# EasyEDA Pro project 轮足机器人主板&核心板.epro, board 主板PCB
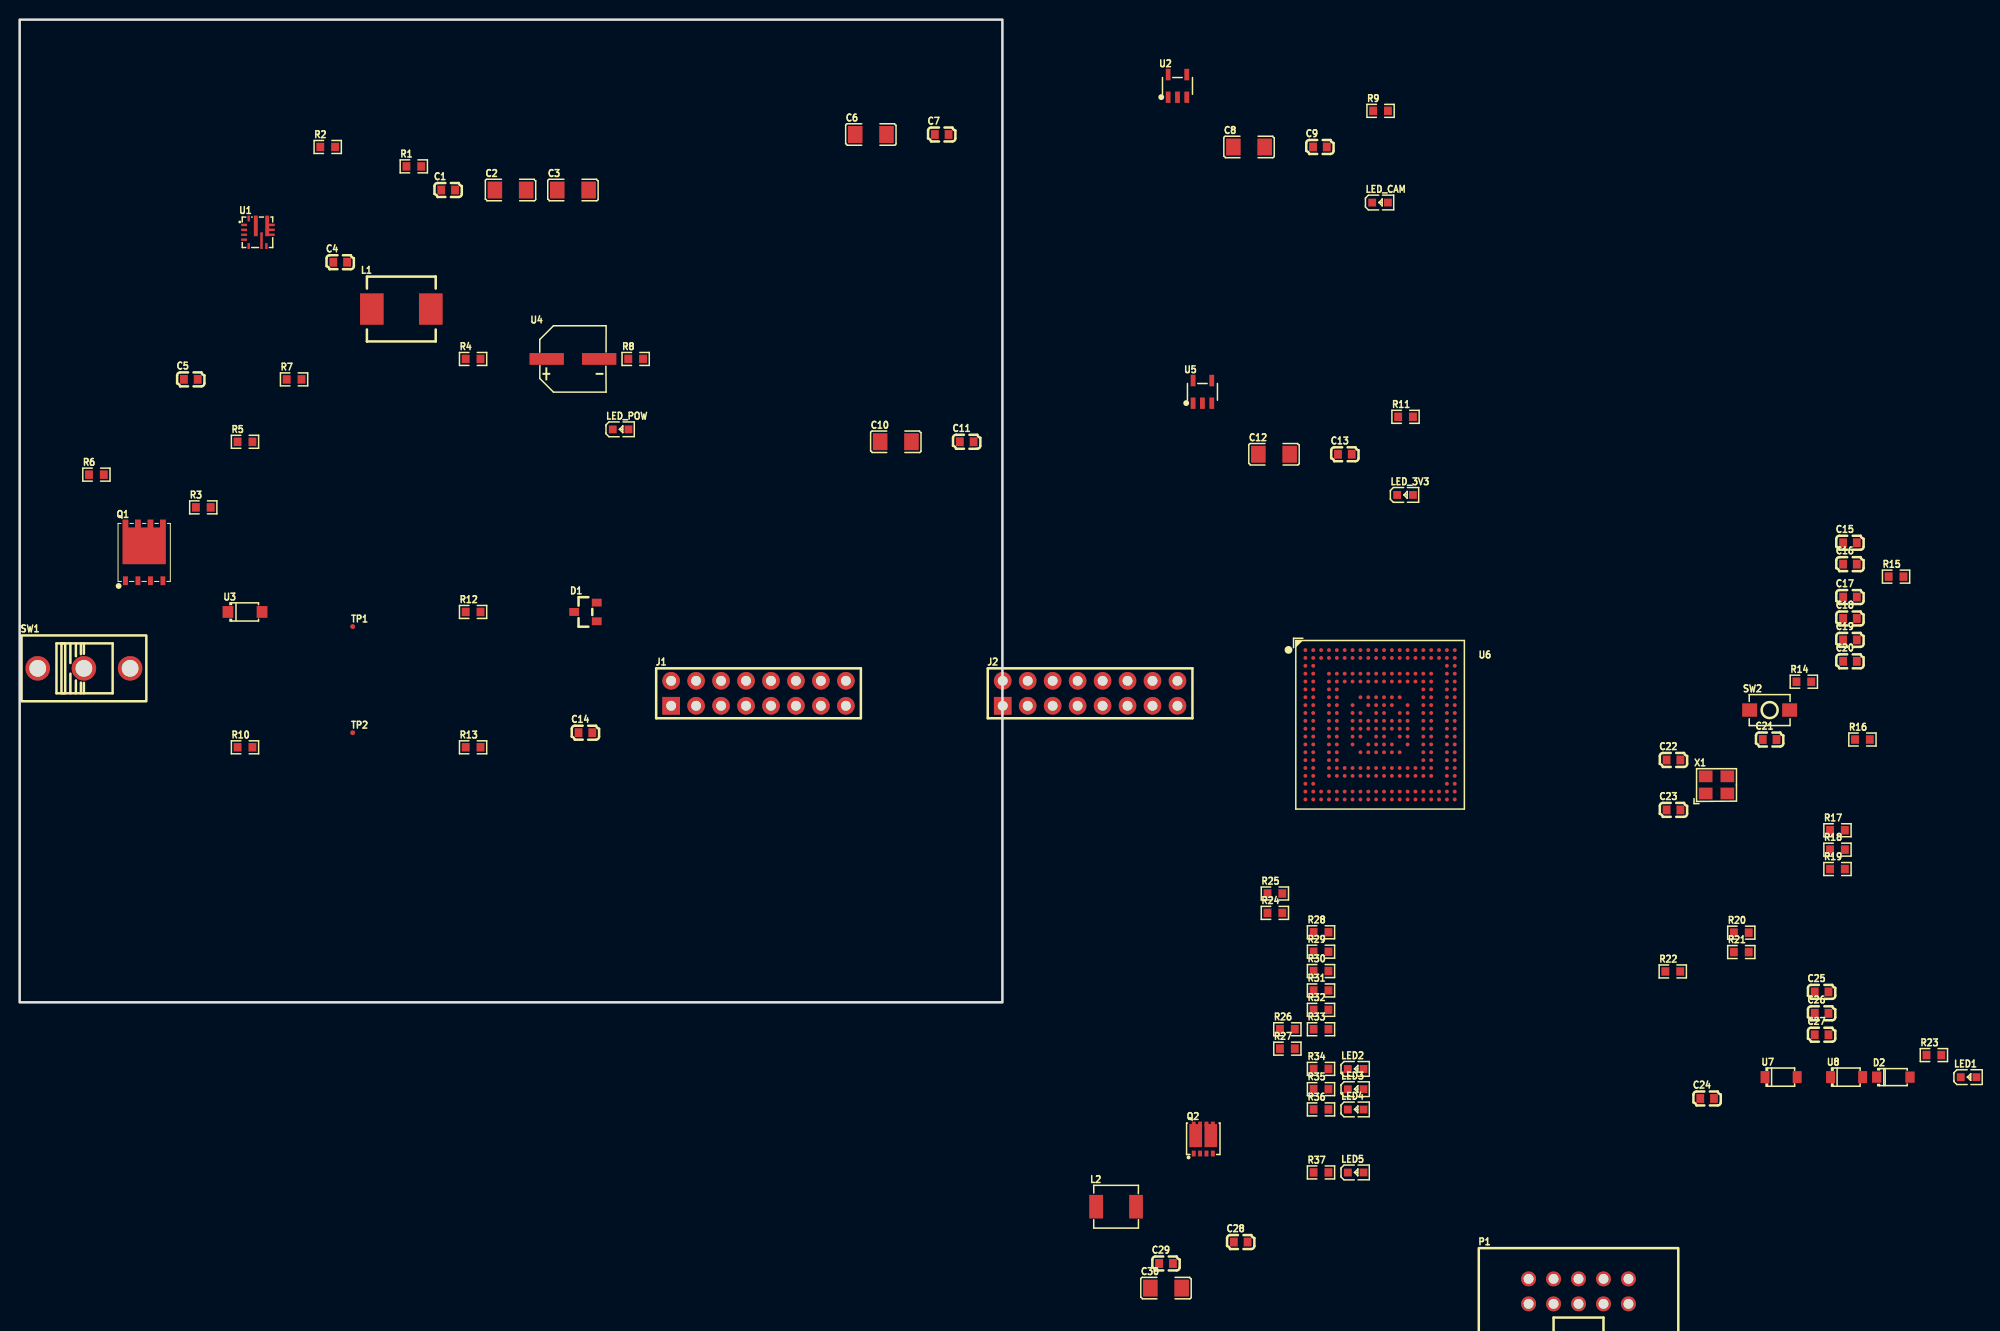
[diagram p7: board, top side]
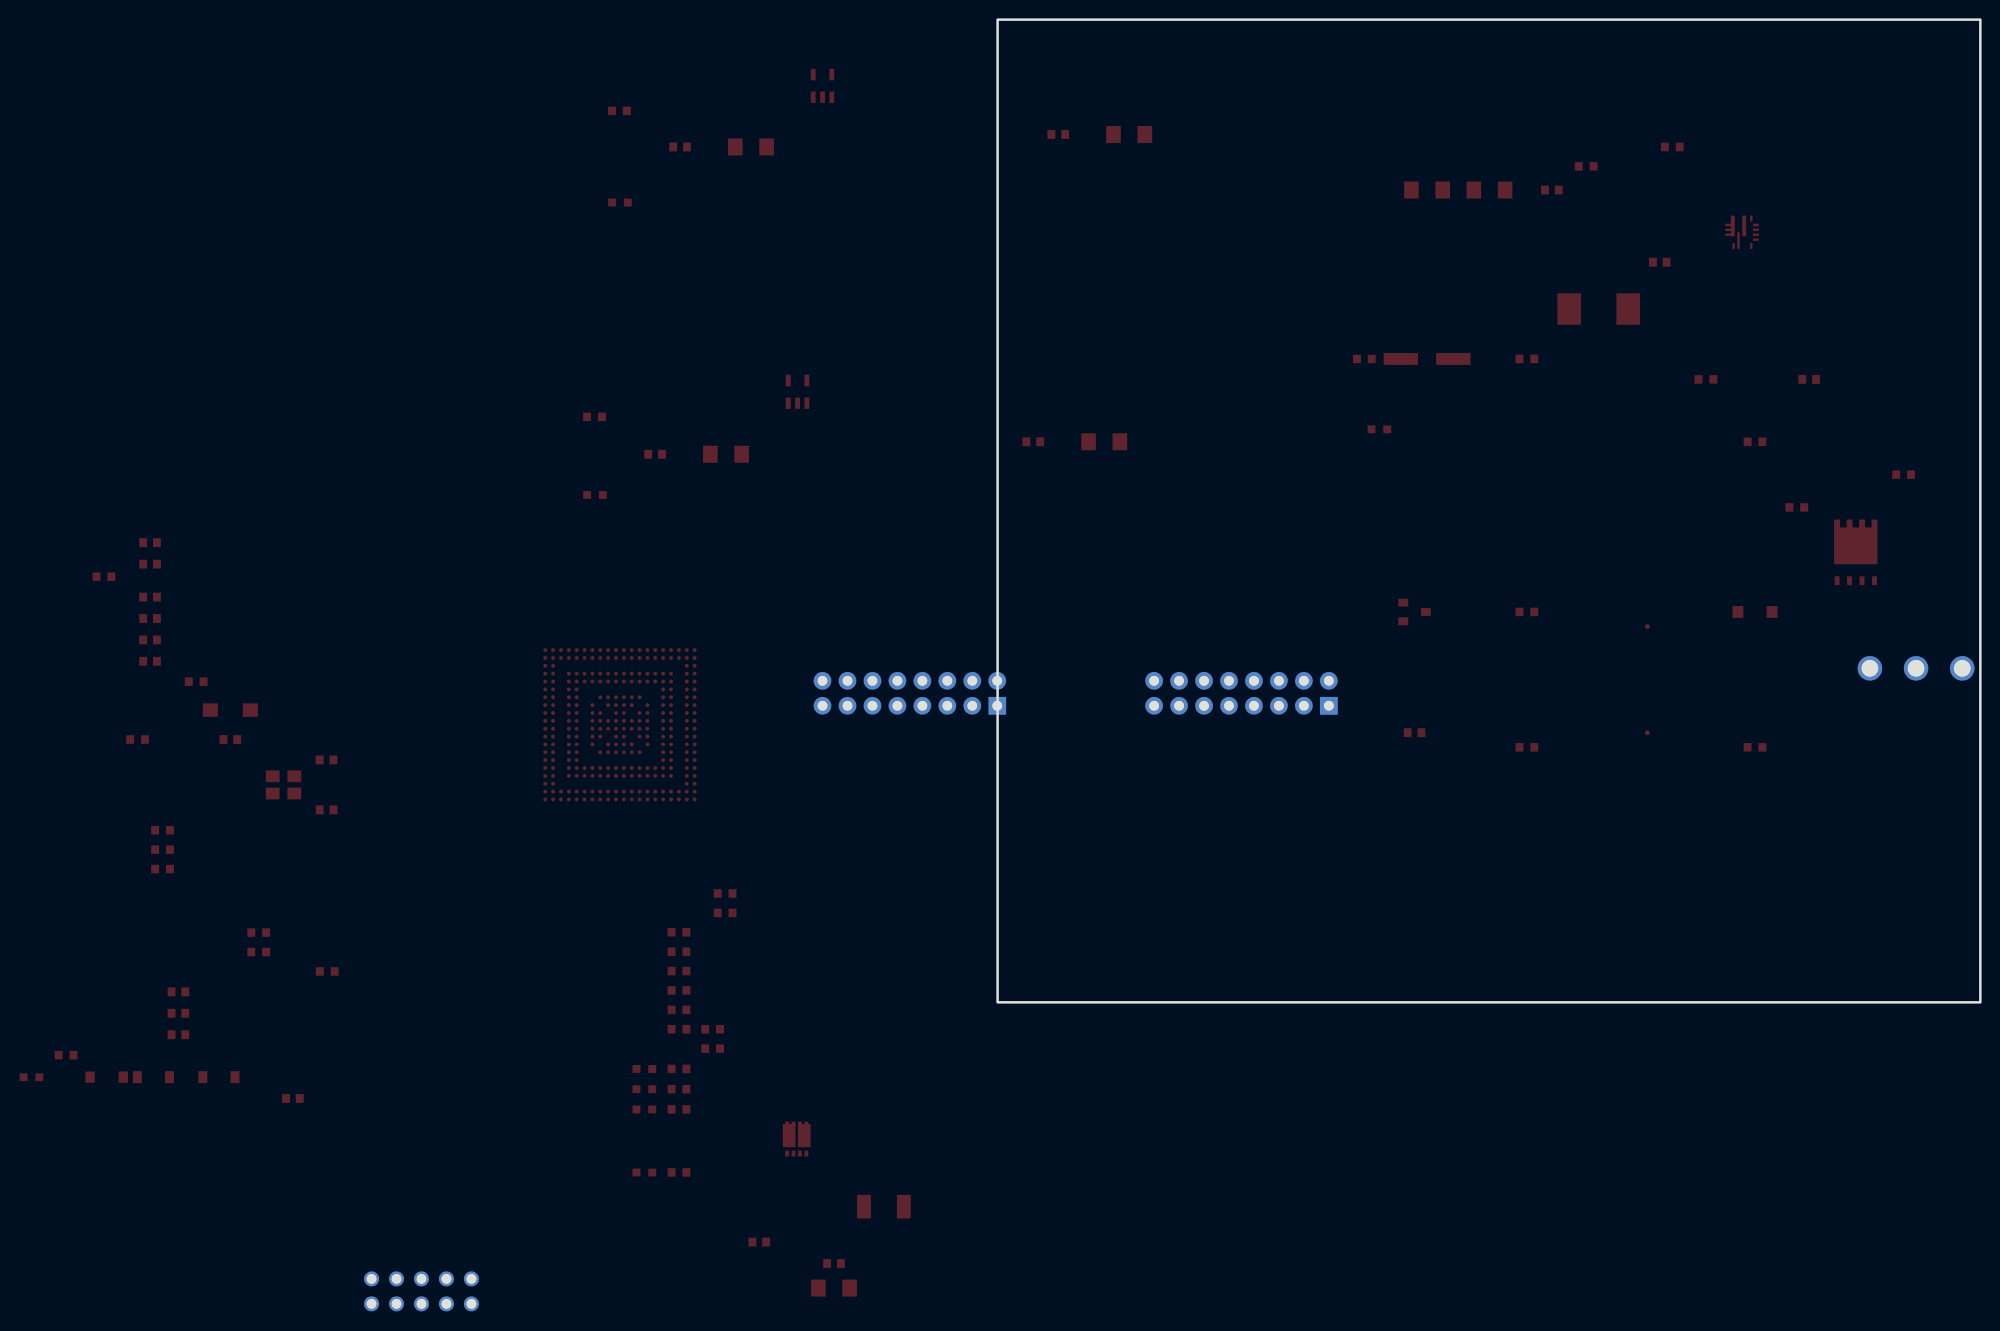
[diagram p8: board, bottom side, seen from below]

Outline 100 x 100 mm; copper layers: Top Layer, Bottom Layer. Coordinates in mm from the lower left corner of the outline.
Outline path: rectangle 0,100 100,0
Stack: Top Layer 0.035mm / Dielectric1 1.51mm FR4 er 4.5 / Bottom Layer 0.035mm

## Design rules (mm)
template: JLCPCB Capability(Two Layers Board)
spacing copperThickness1oz (default): track to track 0.102, other pairs 0.152 to 0.3
spacing copperThickness2oz: track to track 0.203, other pairs 0.152 to 0.3
track width copperThickness1oz (default): min 0.127, default 0.254, max 2.54
track width copperThickness2oz: min 0.203, default 0.254, max 2.54
differential pair differentialPair (default): width min 0.127, default 0.254, max 2.54; gap min 0.152, default 0.152
via viaSize (default): diameter min 0.5, default 0.61, max 10; hole min 0.3, default 0.305, max 6.3

## Placement (name value [footprint] x y rotation side)
C1  100nF  [C0603]  43.6 82.66 0 top
C2  10uF  [C1206]  49.95 82.66 0 top
C3  10uF  [C1206]  56.3 82.66 0 top
C4  100nF  [C0603]  32.62 75.32 0 top
C5  100pF  [C0603]  17.41 63.39 0 top
C6  10uF  [C1206]  86.61 88.31 0 top
C7  100nF  [C0603]  93.83 88.31 0 top
C8  10uF  [C1206]  125.1 87.04 0 top
C9  100nF  [C0603]  132.31 87.04 0 top
C10  10uF  [C1206]  89.15 57.04 0 top
C11  100nF  [C0603]  96.37 57.04 0 top
C12  10uF  [C1206]  127.64 55.77 0 top
C13  100nF  [C0603]  134.85 55.77 0 top
C14  100nF  [C0603]  57.57 27.44 0 top
C15  100nF  [C0603]  186.24 46.77 0 top
C16  100nF  [C0603]  186.24 44.59 0 top
C17  100nF  [C0603]  186.24 41.24 0 top
C18  100nF  [C0603]  186.24 39.06 0 top
C19  100nF  [C0603]  186.24 36.88 0 top
C20  100nF  [C0603]  186.24 34.7 0 top
C21  100nF  [C0603]  178.07 26.75 0 top
C22  20pF  [C0603]  168.28 24.67 0 top
C23  20pF  [C0603]  168.28 19.59 0 top
C24  100nF  [C0603]  171.71 -9.78 0 top
C25  100nF  [C0603]  183.36 1.06 0 top
C26  100nF  [C0603]  183.36 -1.11 0 top
C27  100nF  [C0603]  183.36 -3.29 0 top
C28  22uF  [C0603]  124.25 -24.39 0 top
C29  22uF  [C0603]  116.65 -26.57 0 top
C30  10uF  [C1206]  116.65 -29.08 0 top
D1  BAV99  [SOT-23_L2.9-W1.3-P1.90-LS2.4-BR]  57.57 39.73 0 top
D2  SMF3.3A  [SOD-123_L2.8-W1.8-LS3.7-RD]  190.66 -7.61 0 top
J1  2.54-2*8P母  [HDR-TH_16P-P2.54-V-F-R2-C8-S2.54]  75.18 31.45 0 top
J2  2.54-2*8P母  [HDR-TH_16P-P2.54-V-F-R2-C8-S2.54]  108.92 31.45 0 top
L1  3.3uH  [IND-SMD_L7.0-W6.6]  38.84 70.55 0 top
L2  3.3uH  [IND-SMD_L4.4-W4.2-A]  111.57 -20.8 0 top
LED1  -  [LED_0603]  198.36 -7.61 0 top
LED2  -  [LED_0603]  136 -6.77 0 top
LED3  -  [LED_0603]  136 -8.83 0 top
LED4  -  [LED_0603]  136 -10.9 0 top
LED5  -  [LED_0603]  136 -17.31 0 top
LED_3V3  -  [LED_0603]  141.02 51.64 0 top
LED_CAM  -  [LED_0603]  138.48 81.39 0 top
LED_POW  -  [LED_0603]  61.2 58.31 0 top
P1  2.54-2*5P简牛  [IDC-TH_10P-P2.54_C5665]  158.62 -29.41 0 top
Q1  AGM60P100A  [TDSON-8_L5.9-W5.2-P1.27-BL]  12.67 44.68 0 top
Q2  WSD3045DN  [DFN-8_L3.2-W3.2-P0.65-LS3.4-BL-EP]  120.44 -13.88 0 top
R1  169k  [R0603]  40.11 85.07 0 top
R2  36.1k  [R0603]  31.35 87.04 0 top
R3  0Ω  [R0603]  18.68 50.37 0 top
R4  49.9o  [R0603]  46.14 65.47 0 top
R5  73.2k  [R0603]  22.93 57.04 0 top
R6  10k  [R0603]  7.81 53.7 0 top
R7  20k  [R0603]  27.92 63.39 0 top
R8  4.7k  [R0603]  62.68 65.47 0 top
R9  2.7k  [R0603]  138.48 90.72 0 top
R10  10k  [R0603]  22.93 25.95 0 top
R11  2.7k  [R0603]  141.02 59.58 0 top
R12  200k  [R0603]  46.14 39.73 0 top
R13  22k  [R0603]  46.14 25.95 0 top
R14  0Ω  [R0603]  181.55 32.63 0 top
R15  0Ω  [R0603]  190.93 43.32 0 top
R16  680Ω  [R0603]  187.51 26.75 0 top
R17  10K  [R0603]  184.97 17.51 0 top
R18  0Ω  [R0603]  184.97 15.54 0 top
R19  0Ω  [R0603]  184.97 13.56 0 top
R20  0Ω  [R0603]  175.18 7.09 0 top
R21  0Ω  [R0603]  175.18 5.12 0 top
R22  10K  [R0603]  168.21 3.14 0 top
R23  2.7kΩ  [R0603]  194.78 -5.37 0 top
R24  0Ω  [R0603]  127.73 9.1 0 top
R25  0Ω  [R0603]  127.73 11.08 0 top
R26  0Ω  [R0603]  129 -2.74 0 top
R27  0Ω  [R0603]  129 -4.71 0 top
R28  47kΩ  [R0603]  132.42 7.13 0 top
R29  47kΩ  [R0603]  132.42 5.16 0 top
R30  47kΩ  [R0603]  132.42 3.18 0 top
R31  47kΩ  [R0603]  132.42 1.21 0 top
R32  47kΩ  [R0603]  132.42 -0.76 0 top
R33  47kΩ  [R0603]  132.42 -2.74 0 top
R34  1kΩ  [R0603]  132.42 -6.77 0 top
R35  1kΩ  [R0603]  132.42 -8.83 0 top
R36  1kΩ  [R0603]  132.42 -10.9 0 top
R37  1kΩ  [R0603]  132.42 -17.31 0 top
SW1  SS-12D10L3  [SW-TH_SS-12D10L3]  6.54 33.99 0 top
SW2  -  [Key_SMD_3x4x2]  178.07 29.74 0 top
TP1  -  [Test-Point-0.5mm]  33.89 38.24 0 top
TP2  -  [Test-Point-0.5mm]  33.89 27.44 0 top
U1  TPS56637RPAR  [VQFN-HR-10_L3.0-W3.0_RPA]  24.2 78.36 0 top
U2  RT9013-33GB  [SOT-23-5_L3.0-W1.7-P0.95-LS2.8-BL]  117.81 93.26 0 top
U3  BZT52C16  [SOD-123_L2.7-W1.6-LS3.8-RD]  22.93 39.73 0 top
U4  47uF  [CAP-SMD_BD6.3-L6.6-W6.6-LS7.2-FD]  56.3 65.47 0 top
U5  RT9013-33GB  [SOT-23-5_L3.0-W1.7-P0.95-LS2.8-BL]  120.35 62.12 0 top
U6  SAK-TC377TP-96F300S AA  [PG-LFBGA-292_L17.0-W17.0-BL_SAK-TC1791F]  138.43 28.25 270 top
U7  MM1Z3V6  [SOD-123_L2.7-W1.6-LS3.7-RD]  179.24 -7.61 0 top
U8  MM1Z3V6  [SOD-123_L2.7-W1.6-LS3.7-RD]  185.9 -7.61 0 top
X1  20MHz  [OSC-SMD_4P-L3.2-W2.5-BL]  172.66 22.13 0 top

## Footprints (pads in the part's own frame, mm; a bottom-side part is the same pattern mirrored in y, then rotated)
C0603
  rect 0.8x0.9 smd: 1(-0.7,0) 2(0.7,0)
C1206
  rect 1.485x1.728 smd: 1(-1.593,0) 2(1.593,0)
CAP-SMD_BD6.3-L6.6-W6.6-LS7.2-FD
  rect 3.5x1.2 smd: 1(-2.67,0) 2(2.67,0)
DFN-8_L3.2-W3.2-P0.65-LS3.4-BL-EP
  rect 0.4x0.6 smd: 1(-0.975,-1.5) 2(-0.325,-1.5) 3(0.325,-1.5) 4(0.975,-1.5)
  rect 0.4x0.5 smd: 5(0.975,1.5) 6(0.325,1.5) 7(-0.325,1.5) 8(-0.975,1.5)
  rect 1.29x2.35 smd: 9(-0.77,0.325) 10(0.77,0.325)
HDR-TH_16P-P2.54-V-F-R2-C8-S2.54
  rect 1.8x1.8 hole 1: 1(-8.89,-1.27)
  round 1.8 hole 1: 2(-8.89,1.27) 3(-6.35,-1.27) 4(-6.35,1.27) 5(-3.81,-1.27) 6(-3.81,1.27) 7(-1.27,-1.27) 8(-1.27,1.27) 9(1.27,-1.27) 10(1.27,1.27) 11(3.81,-1.27) 12(3.81,1.27) 13(6.35,-1.27) 14(6.35,1.27) 15(8.89,-1.27) 16(8.89,1.27)
IDC-TH_10P-P2.54_C5665
  round 1.524 hole 1: 1(-5.08,-1.27) 2(-5.08,1.27) 3(-2.54,-1.27) 4(-2.54,1.27) 5(0,-1.27) 6(0,1.27) 7(2.54,-1.27) 8(2.54,1.27) 9(5.08,-1.27) 10(5.08,1.27)
IND-SMD_L4.4-W4.2-A
  rect 1.4x2.4 smd: 1(2.028,0) 2(-2.028,0)
IND-SMD_L7.0-W6.6
  rect 2.4x3.2 smd: 1(-3,0) 2(3,0)
Key_SMD_3x4x2
  rect 1.53x1.36 smd: 1(-2.035,0) 2(2.035,0)
LED_0603
  rect 0.8x0.8 smd: 1(-0.851,-0.01) 2(0.75,-0.005)
OSC-SMD_4P-L3.2-W2.5-BL
  rect 1.4x1.2 smd: 1(-1.1,-0.875) 2(1.1,-0.875) 3(1.1,0.875) 4(-1.1,0.875)
PG-LFBGA-292_L17.0-W17.0-BL_SAK-TC1791F
  round 0.4 smd: A1(-7.6,-7.6) A2(-7.6,-6.8) A3(-7.6,-6) A4(-7.6,-5.2) A5(-7.6,-4.4) A6(-7.6,-3.6) A7(-7.6,-2.8) A8(-7.6,-2) A9(-7.6,-1.2) A10(-7.6,-0.4) A11(-7.6,0.4) A12(-7.6,1.2) A13(-7.6,2) A14(-7.6,2.8) A15(-7.6,3.6) A16(-7.6,4.4) A17(-7.6,5.2) A18(-7.6,6) A19(-7.6,6.8) A20(-7.6,7.6) B1(-6.8,-7.6) B2(-6.8,-6.8) B3(-6.8,-6) B4(-6.8,-5.2) B5(-6.8,-4.4) B6(-6.8,-3.6) B7(-6.8,-2.8) B8(-6.8,-2) B9(-6.8,-1.2) B10(-6.8,-0.4) B11(-6.8,0.4) B12(-6.8,1.2) B13(-6.8,2) B14(-6.8,2.8) B15(-6.8,3.6) B16(-6.8,4.4) B17(-6.8,5.2) B18(-6.8,6) B19(-6.8,6.8) B20(-6.8,7.6) C1(-6,-7.6) C2(-6,-6.8) C19(-6,6.8) C20(-6,7.6) D1(-5.2,-7.6) D2(-5.2,-6.8) D4(-5.2,-5.2) D5(-5.2,-4.4) D6(-5.2,-3.6) D7(-5.2,-2.8) D8(-5.2,-2) D9(-5.2,-1.2) D10(-5.2,-0.4) D11(-5.2,0.4) D12(-5.2,1.2) D13(-5.2,2) D14(-5.2,2.8) D15(-5.2,3.6) D16(-5.2,4.4) D17(-5.2,5.2) D19(-5.2,6.8) D20(-5.2,7.6) E1(-4.4,-7.6) E2(-4.4,-6.8) E4(-4.4,-5.2) E5(-4.4,-4.4) E6(-4.4,-3.6) E7(-4.4,-2.8) E8(-4.4,-2) E9(-4.4,-1.2) E10(-4.4,-0.4) E11(-4.4,0.4) E12(-4.4,1.2) E13(-4.4,2) E14(-4.4,2.8) E15(-4.4,3.6) E16(-4.4,4.4) E17(-4.4,5.2) E19(-4.4,6.8) E20(-4.4,7.6) F1(-3.6,-7.6) F2(-3.6,-6.8) F4(-3.6,-5.2) F5(-3.6,-4.4) F16(-3.6,4.4) F17(-3.6,5.2) F19(-3.6,6.8) F20(-3.6,7.6) G1(-2.8,-7.6) G2(-2.8,-6.8) G4(-2.8,-5.2) G5(-2.8,-4.4) G8(-2.8,-2) G9(-2.8,-1.2) G10(-2.8,-0.4) G11(-2.8,0.4) G12(-2.8,1.2) G13(-2.8,2) G16(-2.8,4.4) G17(-2.8,5.2) G19(-2.8,6.8) G20(-2.8,7.6) H1(-2,-7.6) H2(-2,-6.8) H4(-2,-5.2) H5(-2,-4.4) H7(-2,-2.8) H9(-2,-1.2) H10(-2,-0.4) H11(-2,0.4) H12(-2,1.2) H14(-2,2.8) H16(-2,4.4) H17(-2,5.2) H19(-2,6.8) H20(-2,7.6) J1(-1.2,-7.6) J2(-1.2,-6.8) J4(-1.2,-5.2) J5(-1.2,-4.4) J7(-1.2,-2.8) J8(-1.2,-2) J10(-1.2,-0.4) J11(-1.2,0.4) J13(-1.2,2) J14(-1.2,2.8) J16(-1.2,4.4) J17(-1.2,5.2) J19(-1.2,6.8) J20(-1.2,7.6) K1(-0.4,-7.6) K2(-0.4,-6.8) K4(-0.4,-5.2) K5(-0.4,-4.4) K7(-0.4,-2.8) K8(-0.4,-2) K9(-0.4,-1.2) K10(-0.4,-0.4) K11(-0.4,0.4) K12(-0.4,1.2) K13(-0.4,2) K14(-0.4,2.8) K16(-0.4,4.4) K17(-0.4,5.2) K19(-0.4,6.8) K20(-0.4,7.6) L1(0.4,-7.6) L2(0.4,-6.8) L4(0.4,-5.2) L5(0.4,-4.4) L7(0.4,-2.8) L8(0.4,-2) L9(0.4,-1.2) L10(0.4,-0.4) L11(0.4,0.4) L12(0.4,1.2) L13(0.4,2) L14(0.4,2.8) L16(0.4,4.4) L17(0.4,5.2) L19(0.4,6.8) L20(0.4,7.6) M1(1.2,-7.6) M2(1.2,-6.8) M4(1.2,-5.2) M5(1.2,-4.4) M7(1.2,-2.8) M8(1.2,-2) M10(1.2,-0.4) M11(1.2,0.4) M13(1.2,2) M14(1.2,2.8) M16(1.2,4.4) M17(1.2,5.2) M19(1.2,6.8) M20(1.2,7.6) N1(2,-7.6) N2(2,-6.8) N4(2,-5.2) N5(2,-4.4) N7(2,-2.8) N9(2,-1.2) N10(2,-0.4) N11(2,0.4) N12(2,1.2) N14(2,2.8) N16(2,4.4) N17(2,5.2) N19(2,6.8) N20(2,7.6) P1(2.8,-7.6) P2(2.8,-6.8) P4(2.8,-5.2) P5(2.8,-4.4) P8(2.8,-2) P9(2.8,-1.2) P10(2.8,-0.4) P11(2.8,0.4) P12(2.8,1.2) P13(2.8,2) P16(2.8,4.4) P17(2.8,5.2) P19(2.8,6.8) P20(2.8,7.6) R1(3.6,-7.6) R2(3.6,-6.8) R4(3.6,-5.2) R5(3.6,-4.4) R16(3.6,4.4) R17(3.6,5.2) R19(3.6,6.8) R20(3.6,7.6) T1(4.4,-7.6) T2(4.4,-6.8) T4(4.4,-5.2) T5(4.4,-4.4) T6(4.4,-3.6) T7(4.4,-2.8) T8(4.4,-2) T9(4.4,-1.2) T10(4.4,-0.4) T11(4.4,0.4) T12(4.4,1.2) T13(4.4,2) T14(4.4,2.8) T15(4.4,3.6) T16(4.4,4.4) T17(4.4,5.2) T19(4.4,6.8) T20(4.4,7.6) U1(5.2,-7.6) U2(5.2,-6.8) U4(5.2,-5.2) U5(5.2,-4.4) U6(5.2,-3.6) U7(5.2,-2.8) U8(5.2,-2) U9(5.2,-1.2) U10(5.2,-0.4) U11(5.2,0.4) U12(5.2,1.2) U13(5.2,2) U14(5.2,2.8) U15(5.2,3.6) U16(5.2,4.4) U17(5.2,5.2) U19(5.2,6.8) U20(5.2,7.6) V1(6,-7.6) V2(6,-6.8) V19(6,6.8) V20(6,7.6) W1(6.8,-7.6) W2(6.8,-6.8) W3(6.8,-6) W4(6.8,-5.2) W5(6.8,-4.4) W6(6.8,-3.6) W7(6.8,-2.8) W8(6.8,-2) W9(6.8,-1.2) W10(6.8,-0.4) W11(6.8,0.4) W12(6.8,1.2) W13(6.8,2) W14(6.8,2.8) W15(6.8,3.6) W16(6.8,4.4) W17(6.8,5.2) W18(6.8,6) W19(6.8,6.8) W20(6.8,7.6) Y1(7.6,-7.6) Y2(7.6,-6.8) Y3(7.6,-6) Y4(7.6,-5.2) Y5(7.6,-4.4) Y6(7.6,-3.6) Y7(7.6,-2.8) Y8(7.6,-2) Y9(7.6,-1.2) Y10(7.6,-0.4) Y11(7.6,0.4) Y12(7.6,1.2) Y13(7.6,2) Y14(7.6,2.8) Y15(7.6,3.6) Y16(7.6,4.4) Y17(7.6,5.2) Y18(7.6,6) Y19(7.6,6.8) Y20(7.6,7.6)
R0603
  rect 0.806x0.864 smd: 1(-0.753,0) 2(0.753,0)
SOD-123_L2.7-W1.6-LS3.7-RD
  rect 0.91x1.22 smd: 1(-1.635,0) 2(1.635,0)
SOD-123_L2.7-W1.6-LS3.8-RD
  rect 1.1x1.2 smd: 1(-1.735,0) 2(1.735,0)
SOD-123_L2.8-W1.8-LS3.7-RD
  rect 0.95x1.15 smd: 1(-1.692,0) 2(1.692,0)
SOT-23-5_L3.0-W1.7-P0.95-LS2.8-BL
  rect 0.49x1.157 smd: 1(-0.95,-1.153) 2(0,-1.153) 3(0.95,-1.153)
  rect 0.49x1.175 smd: 4(0.95,1.153) 5(-0.95,1.153)
SOT-23_L2.9-W1.3-P1.90-LS2.4-BR
  rect 1x0.8 smd: 1(1.15,-0.95) 2(1.15,0.95) 3(-1.15,0)
SW-TH_SS-12D10L3
  round 2.5 hole 1.7: 1(-4.7,0) 2(0,0) 3(4.7,0)
TDSON-8_L5.9-W5.2-P1.27-BL
  rect 0.5x0.9 smd: 1(-1.905,-1.775) 2(-0.635,-1.775) 3(0.635,-1.775) 4(1.905,-1.775)
  custom 4.41x4.55 smd: 5(0,1.775)
Test-Point-0.5mm
  round 0.5 smd: 1(0,0)
VQFN-HR-10_L3.0-W3.0_RPA
  rect 0.6x0.25 smd: 1(-1.36,0.75) 2(-1.36,0.25) 3(-1.36,-0.25) 4(-1.36,-0.75)
  rect 0.25x0.6 smd: 5(-0.89,-1.4) 7(0.91,-1.4) 10(-0.89,1.4)
  rect 0.25x1.7 smd: 6(0.41,-0.85)
  rect 0.4x2.1 smd: 8(0.99,0.65) 9(-0.17,0.65)
  rect 0.8x0.25 smd: 8(1.36,0.75) 8(1.36,0.25) 8(1.36,-0.25)

## Nets
As in the schematic, except:
AGND: R1.2 R2.1 R3.1 R6.1 U1.1 U1.3
GNDCORE: C15.1 C16.1 C17.1 C18.1 C19.1 C20.1 C21.1 C22.1 C23.1 C24.1 C28.1 C29.1 C30.1 D2.2 LED1.1 P1.3 P1.5 Q2.1 R15.2 R28.2 SW2.1 U6.A20 U6.B2 U6.B19 U6.D4 U6.D17 U6.E5 U6.E16 U6.G9 U6.G10 U6.G11 U6.G12 U6.H9 U6.H10 U6.H11 U6.H12 U6.J7 U6.J8 U6.J10 U6.J11 U6.J13 U6.J14 U6.K7 U6.K8 U6.K9 U6.K10 U6.K11 U6.K12 U6.K13 U6.L7 U6.L8 U6.L9 U6.L10 U6.L11 U6.L12 U6.L13 U6.L14 U6.L20 U6.M7 U6.M8 U6.M10 U6.M11 U6.M13 U6.M14 U6.N9 U6.N10 U6.N11 U6.N12 U6.P9 U6.P10 U6.P11 U6.P12 U6.T16 U6.U17 U6.W19 U6.Y20 U7.2 U8.2 X1.2 X1.4

Pads without a net: J1 1 2 3 5 6 7 8 9 10 11 12 13 15; J2 1 3 5 6 7 8 9 10 11 12 13 14 15 16; U1 4 5; U2 4; U5 4; U6 A1 A7 A13 B4 B6 D6 D7 D8 D10 D11 D12 D13 E4 E6 E7 E8 E9 E10 E11 E12 F4 F5 G4 G5 H4 H5 J5 J17 K5 K14 K17 L1 M4 M5 M16 M17 N16 N17 P4 P16 P17 R1 R4 R5 R16 R17 T4 T5 T6 T12 T13 T14 T15 T17 T19 T20 U1 U2 U4 U6 U7 U11 U12 U13 U14 U15 U16 U20 V1 V2 V20 W3 W4 W10 W11 Y1 Y10 Y11 Y18 Y19
